# Altium project Power bank.PrjPcb (part 2 of 3)
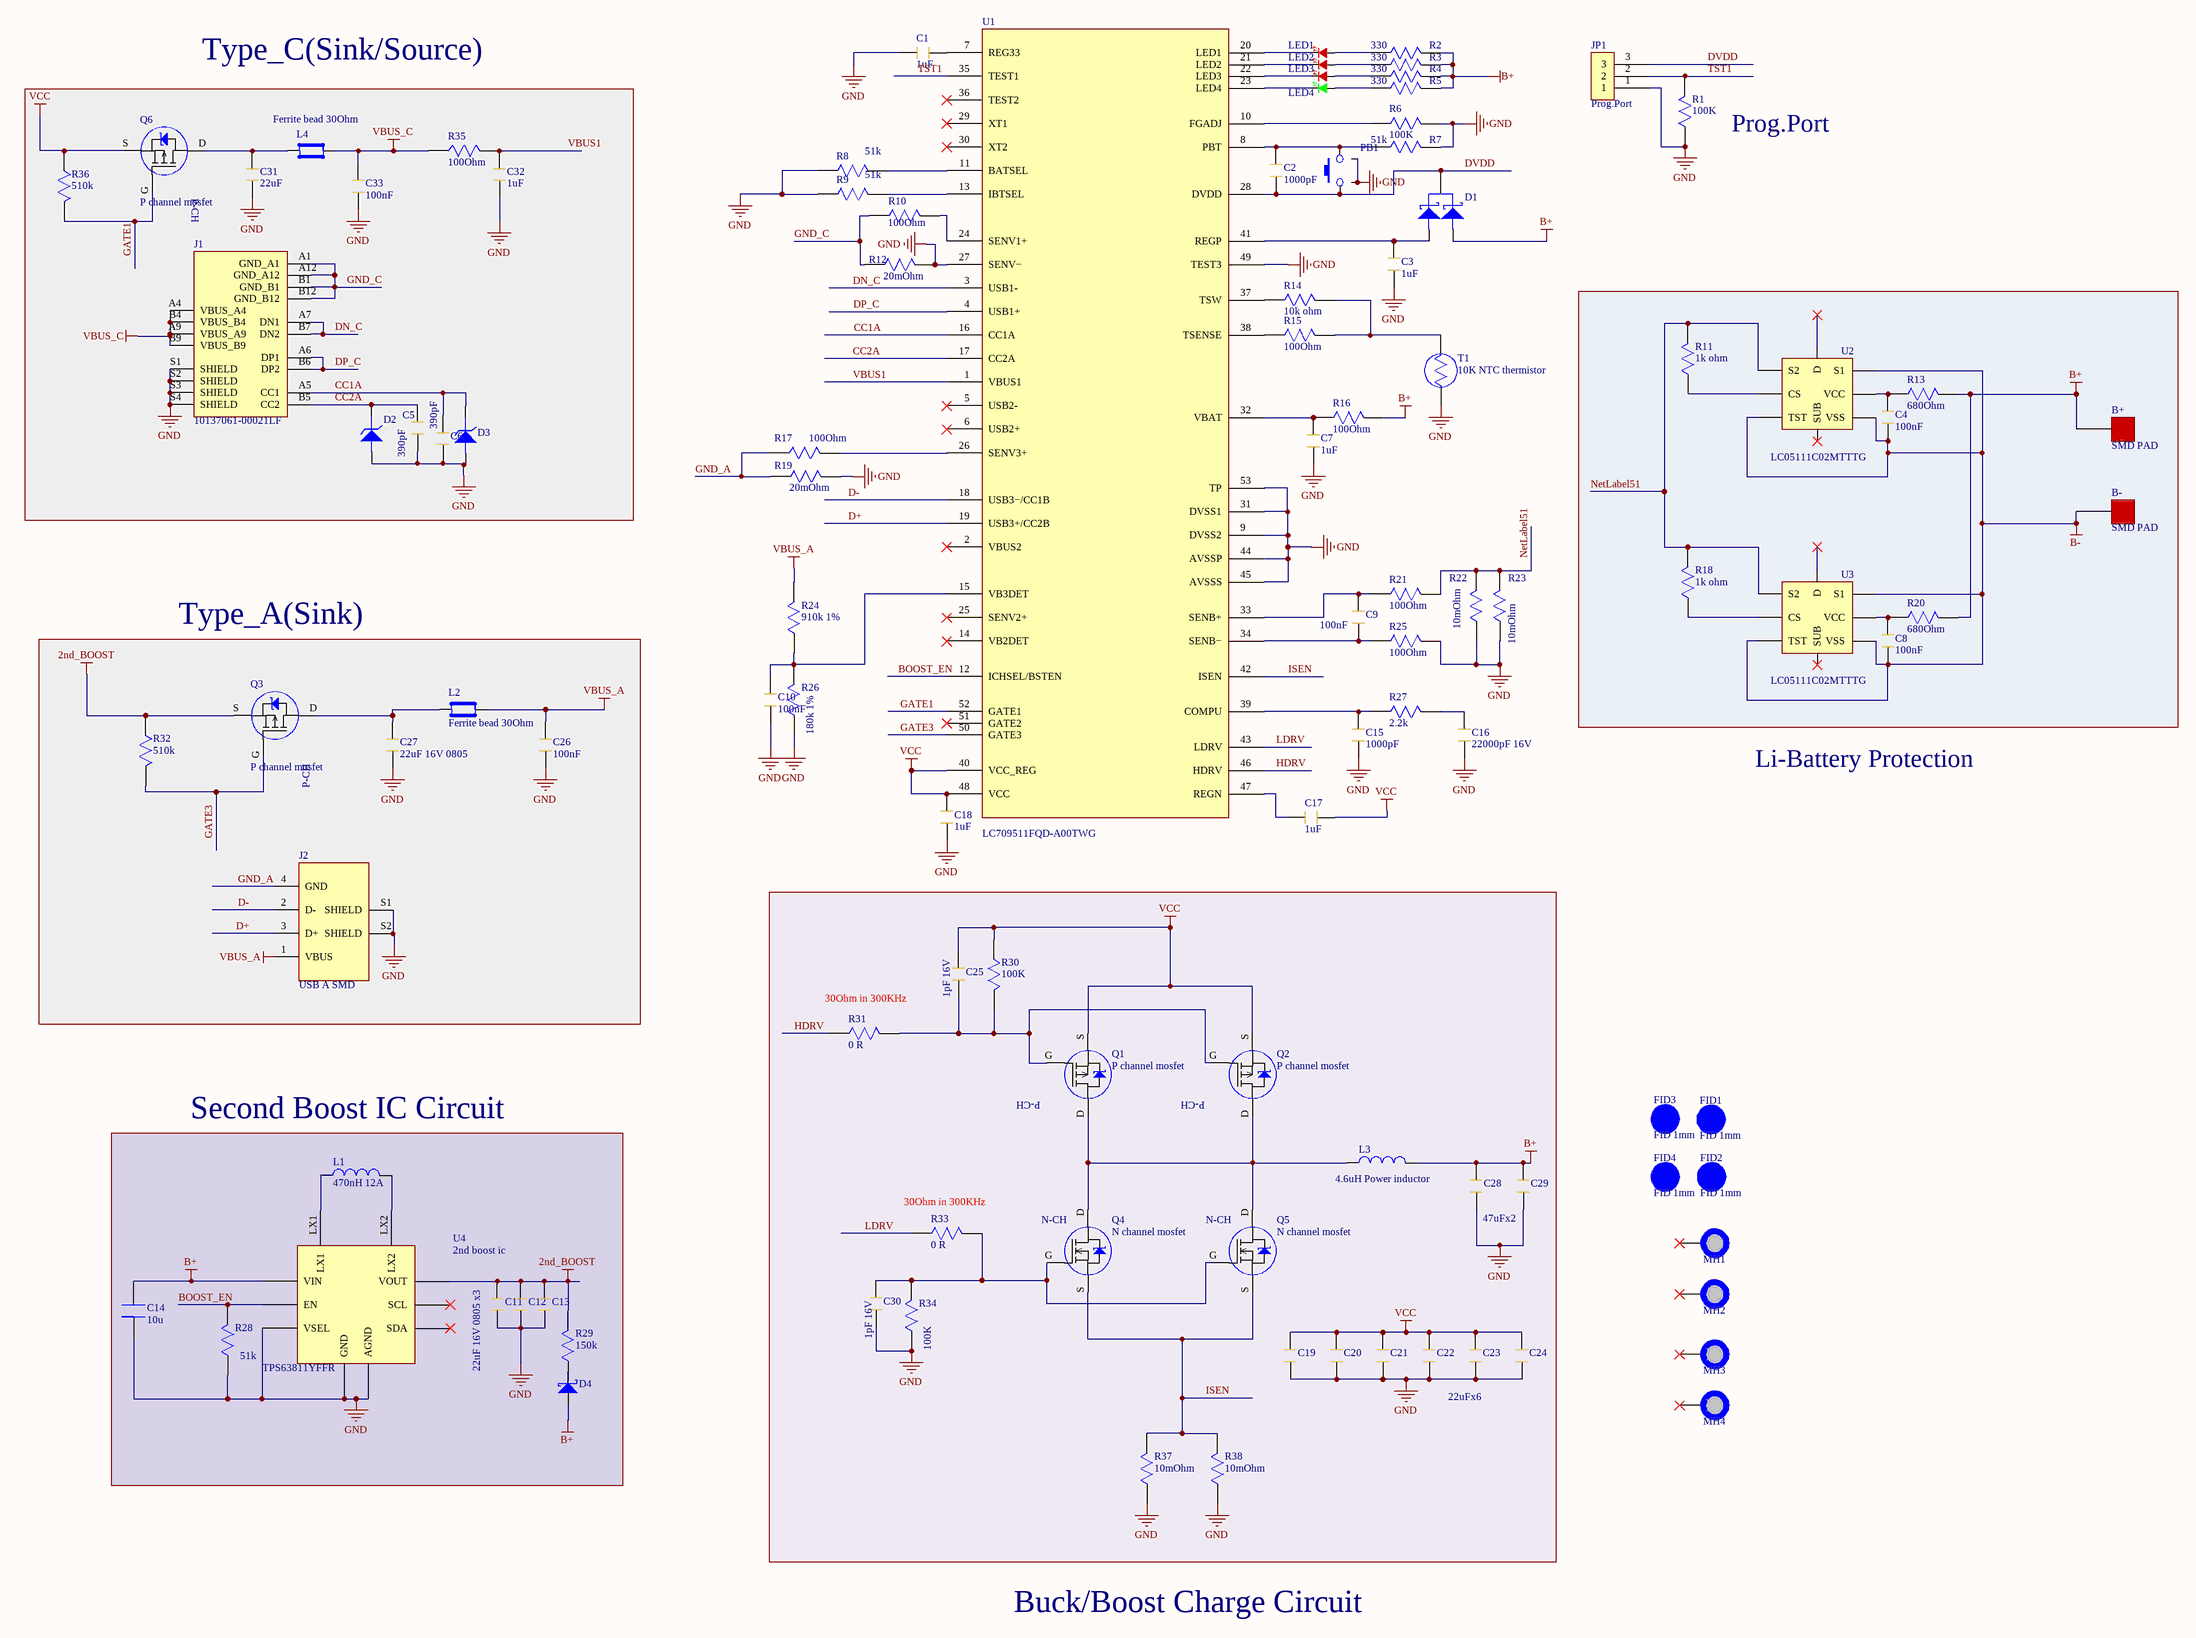
[diagram p1: 4layer schematic.SchDoc]

## Sheet 4layer schematic.SchDoc: Power Bank   by Abdelrahman Ahmed (continued)
### Library data of the parts
C1 C3 C7 C17 C18 C32 = 1uF cap: Cap Ceramic 1uF 16V Y5V -20% to 80% SMD 0603 85C T/R; Manufacturer 1: Yageo; Manufacturer Part Number 1: CC0603ZRY5V7BB105; Dissipation Factor: 12.5%; Supplier 1: Digi-Key; Stock 1: 1011162; Pricing 1: 1=0.10000, 10=0.07600, 50=0.04160, 100=0.03400, 500=0.02426, 1000=0.01906 (USD); RoHS: Yes; Mount: Surface Mount; Case/Package: 0603; Case Code (Metric): 1608; Case Code (Imperial): 0603; Min Operating Temperature: -30°C; Max Operating Temperature: 85°C; Voltage Rating (DC): 16V; Dielectric: Y5V; Termination: SMD/SMT; Composition: Ceramic; Capacitance: 1uF; Tolerance: 80%; Package Quantity: 1; Voltage Rating: 16V; Packaging: Tape and Reel; Length: 1.6mm; Height: 0.8mm; Thickness: 0.035inch; Depth: 0.8mm; Width: 0.031inch; Radiation Hardening: No; REACH SVHC: Unknown; Lead Free: Lead Free; Halogen Free: Halogen Free; ComponentLink1URL: https://datasheet.ciiva.com/26936/getdatasheetpartid-782716-26936063.pdf?src-supplier=Verical; ComponentLink1Description: https://datasheet.ciiva.com/26936/getdatasheetpartid-782716-26936063.pdf?src-supplier=Verical; ComponentLink2URL: https://datasheet.ciiva.com/144/mlccorderingcode-144385.pdf?src-supplier=Digi-Key; ComponentLink2Description: https://datasheet.ciiva.com/144/mlccorderingcode-144385.pdf?src-supplier=Digi-Key; ComponentLink3URL: https://datasheet.ciiva.com/144/mlccorderingcode-144386.pdf?src-supplier=Digi-Key; ComponentLink3Description: https://datasheet.ciiva.com/144/mlccorderingcode-144386.pdf?src-supplier=Digi-Key; ComponentLink4URL: https://datasheet.ciiva.com/144/mlccorderingcode-144387.pdf?src-supplier=Digi-Key; ComponentLink4Description: https://datasheet.ciiva.com/144/mlccorderingcode-144387.pdf?src-supplier=Digi-Key; ComponentLink5URL: https://datasheet.ciiva.com/7978/1132289-7978188.pdf?src-supplier=Element14; ComponentLink5Description: https://datasheet.ciiva.com/7978/1132289-7978188.pdf?src-supplier=Element14; ComponentLink6URL: https://datasheet.ciiva.com/11587/upy-gphc-y5v-6-3v-to-50v-5-11587228.pdf?src-supplier=Avnet; ComponentLink6Description: https://datasheet.ciiva.com/11587/upy-gphc-y5v-6-3v-to-50v-5-11587228.pdf?src-supplier=Avnet; ComponentLink7URL: https://datasheet.ciiva.com/5425/upy-gphc-y5v-6-3v-to-50v-5-5425454.pdf?src-supplier=Mouser; ComponentLink7Description: https://datasheet.ciiva.com/5425/upy-gphc-y5v-6-3v-to-50v-5-5425454.pdf?src-supplier=Mouser; ComponentLink8URL: https://datasheet.ciiva.com/16623/upy-gphc-y5v-6-3v-to-50v-5-16623902.pdf?src-supplier=Avnet+Europe; ComponentLink8Description: https://datasheet.ciiva.com/16623/upy-gphc-y5v-6-3v-to-50v-5-16623902.pdf?src-supplier=Avnet+Europe; Supplier Part Number 1: 311-1372-1-ND
C2 C15 = 1000pF cap: Cap Ceramic 0.001uF 16V X7R 10% Pad SMD 0402 125C T/R; Manufacturer 1: Yageo; Manufacturer Part Number 1: CC0402KRX7R7BB102; Capacitance: 1nF; Supplier 1: Digi-Key; Stock 1: 549923; Pricing 1: 1=0.10000, 10=0.02000, 50=0.01120, 100=0.00910, 500=0.00650, 1000=0.00511, 2500=0.00465, 5000=0.00428 (USD); RoHS: Yes; Mount: Surface Mount; Case/Package: 0402; Case Code (Imperial): 0402; Case Code (Metric): 1005; Min Operating Temperature: -55°C; Max Operating Temperature: 125°C; Packaging: Tape and Reel; Tolerance: 10%; Voltage Rating: 16V; Voltage Rating (DC): 16V; Package Quantity: 1; Dielectric: X7R; Termination: SMD/SMT; Composition: Ceramic; Length: 1mm; Height: 0.5mm; Width: 0.5mm; Thickness: 0.022inch; Depth: 0.5mm; Radiation Hardening: No; REACH SVHC: No SVHC; Lead Free: Lead Free; Halogen Free: Halogen Free; ComponentLink1URL: https://datasheet.ciiva.com/143/mlccorderingcode-143963.pdf?src-supplier=Digi-Key; ComponentLink1Description: https://datasheet.ciiva.com/143/mlccorderingcode-143963.pdf?src-supplier=Digi-Key; ComponentLink2URL: https://datasheet.ciiva.com/26862/getdatasheetpartid-698313-26862635.pdf?src-supplier=Verical; ComponentLink2Description: https://datasheet.ciiva.com/26862/getdatasheetpartid-698313-26862635.pdf?src-supplier=Verical; ComponentLink3URL: https://datasheet.ciiva.com/143/mlccorderingcode-143964.pdf?src-supplier=Digi-Key; ComponentLink3Description: https://datasheet.ciiva.com/143/mlccorderingcode-143964.pdf?src-supplier=Digi-Key; ComponentLink4URL: https://datasheet.ciiva.com/17437/upy-gphc-x7r-6-3v-to-50v-8-17437337.pdf?src-supplier=Avnet+Europe; ComponentLink4Description: https://datasheet.ciiva.com/17437/upy-gphc-x7r-6-3v-to-50v-8-17437337.pdf?src-supplier=Avnet+Europe; ComponentLink5URL: https://datasheet.ciiva.com/143/mlccorderingcode-143962.pdf?src-supplier=Digi-Key; ComponentLink5Description: https://datasheet.ciiva.com/143/mlccorderingcode-143962.pdf?src-supplier=Digi-Key; ComponentLink6URL: https://datasheet.ciiva.com/7978/1489800-7978107.pdf?src-supplier=Element14; ComponentLink6Description: https://datasheet.ciiva.com/7978/1489800-7978107.pdf?src-supplier=Element14; ComponentLink7URL: https://datasheet.ciiva.com/11464/upy-gphc-x7r-6-3v-to-50v-8-11464876.pdf?src-supplier=Avnet; ComponentLink7Description: https://datasheet.ciiva.com/11464/upy-gphc-x7r-6-3v-to-50v-8-11464876.pdf?src-supplier=Avnet; Supplier Part Number 1: 311-1352-6-ND
C4 C8-C10 = 0.1uF cap: Cap Ceramic 0.1uF 16V X7R 10% SMD 0402 125C Paper T/R; Manufacturer 1: Yageo; Manufacturer Part Number 1: CC0402KPX7R7BB104; Supplier 1: Digi-Key; Stock 1: 61577; Pricing 1: 1=0.10000, 10=0.03200, 50=0.01760, 100=0.01430, 500=0.01024, 1000=0.00805, 2500=0.00732, 5000=0.00673 (USD); RoHS: Yes; Mount: Surface Mount; Case/Package: 0402; Weight: 2.3E-05oz; Case Code (Imperial): 0402; Case Code (Metric): 1005; Min Operating Temperature: -55°C; Max Operating Temperature: 125°C; Tolerance: 10%; Packaging: Tape and Reel; Capacitance: 100nF; Voltage Rating (DC): 16V; Dielectric: X7R; Termination: SMD/SMT; Composition: Ceramic; Voltage Rating: 16V; Length: 0.039inch; Width: 0.02inch; Thickness: 0.022inch; Depth: 0.5mm; Lead Free: Lead Free; Halogen Free: Halogen Free; ComponentLink1URL: https://datasheet.ciiva.com/13207/upy-gphc-x7r-6-3v-to-50v-8-12304-13207933.pdf?src-supplier=Mouser; ComponentLink1Description: https://datasheet.ciiva.com/13207/upy-gphc-x7r-6-3v-to-50v-8-12304-13207933.pdf?src-supplier=Mouser; Supplier Part Number 1: 311-3559-1-ND
C5 C6 = 390pF smd cap: Cap Ceramic 390pF 16V X7R 10% SMD 0201 125C Paper T/R; Manufacturer 1: Kyocera AVX; Manufacturer Part Number 1: 0201YC391KAT2A; Supplier 1: Digi-Key; Stock 1: 15630; Pricing 1: 1=0.39000, 10=0.27200, 50=0.19060, 100=0.16340, 500=0.12252, 1000=0.10346, 2500=0.09801, 5000=0.09257 (USD); RoHS: Yes; Mount: Surface Mount; Case/Package: 0201; Number of Pins: 2; Case Code (Imperial): 0201; Case Code (Metric): 0603; Min Operating Temperature: -55°C; Max Operating Temperature: 125°C; Capacitance: 390pF; Tolerance: 10%; Voltage Rating: 16V; Package Quantity: 1; Voltage Rating (DC): 16V; Packaging: Tape and Reel; Dielectric: X7R; Termination: SMD/SMT; Length: 0.6mm; Width: 0.3mm; Thickness: 0.013inch; Depth: 0.3mm; Radiation Hardening: No; REACH SVHC: Unknown; Lead Free: Lead Free; ComponentLink1URL: https://datasheet.ciiva.com/152/cx7r-152454.pdf?src-supplier=Digi-Key; ComponentLink1Description: https://datasheet.ciiva.com/152/cx7r-152454.pdf?src-supplier=Digi-Key; ComponentLink2URL: https://datasheet.ciiva.com/152/cx7r-152455.pdf?src-supplier=Digi-Key; ComponentLink2Description: https://datasheet.ciiva.com/152/cx7r-152455.pdf?src-supplier=Digi-Key; ComponentLink3URL: https://datasheet.ciiva.com/152/cx7r-152456.pdf?src-supplier=Digi-Key; ComponentLink3Description: https://datasheet.ciiva.com/152/cx7r-152456.pdf?src-supplier=Digi-Key; Supplier Part Number 1: 478-1034-1-ND
C11-C13 C19-C24 C27 C31 = GRM21BR61C226ME44L: Cap Ceramic 22uF 16V X5R 20% Pad SMD 0805 85C T/R
C14 = C2012X5R1C106M125AC: CAP CER 10UF 16V X5R 0805; Manufacturer 1: TDK; Dielectric Material: Ceramic; Tolerance: 20%; Supplier 1: Farnell; Manufacturer Part Number 1: C2012X5R1C106M125AC; Stock 1: 0; Pricing 1: 5=0.27200, 50=0.09480, 250=0.08030, 500=0.07090, 1000=0.06220, 2000=0.04880, 10000=0.04830, 20000=0.04180 (GBP); RoHS: Yes; Mount: Surface Mount; Case/Package: 0805; Number of Pins: 2; Weight: 0.000194oz; Case Code (Metric): 2012; Case Code (Imperial): 0805; Min Operating Temperature: -55°C; Max Operating Temperature: 85°C; Capacitance: 10uF; Voltage Rating: 16V; Packaging: Tape and Reel; Voltage Rating (DC): 16V; Dielectric: X5R; Termination: SMD/SMT; Package Quantity: 1; Composition: Ceramic; Length: 2mm; Height: 1.25mm; Width: 0.049inch; Depth: 1.25mm; Thickness: 0.057inch; REACH SVHC: No SVHC; Lead Free: Lead Free; ComponentLink1URL: https://datasheet.ciiva.com/6289/tdkmlcccaprange-6289238.pdf?src-supplier=Digi-Key; ComponentLink1Description: https://datasheet.ciiva.com/6289/tdkmlcccaprange-6289238.pdf?src-supplier=Digi-Key; ComponentLink2URL: https://datasheet.ciiva.com/22725/1913358-22725558.pdf?src-supplier=Element14; ComponentLink2Description: https://datasheet.ciiva.com/22725/1913358-22725558.pdf?src-supplier=Element14; ComponentLink3URL: https://datasheet.ciiva.com/6252/tdkmlcccaprange-6252105.pdf?src-supplier=Digi-Key; ComponentLink3Description: https://datasheet.ciiva.com/6252/tdkmlcccaprange-6252105.pdf?src-supplier=Digi-Key; ComponentLink4URL: https://datasheet.ciiva.com/6252/tdkmlcccaprange-6252108.pdf?src-supplier=Digi-Key; ComponentLink4Description: https://datasheet.ciiva.com/6252/tdkmlcccaprange-6252108.pdf?src-supplier=Digi-Key; ComponentLink5URL: https://datasheet.ciiva.com/23803/1796654-23803022.pdf?src-supplier=Newark; ComponentLink5Description: https://datasheet.ciiva.com/23803/1796654-23803022.pdf?src-supplier=Newark; Supplier Part Number 1: 2525134
C16 = 22000pF cap: YAGEO - CC0402KRX7R7BB223 - SMD Multilayer Ceramic Capacitor, 22000 pF, 16 V, 0402 [1005 Metric], ± 10%, X7R, CC Series; Capacitance: 22nF; Insulation Resistance: 10GR; Dissipation Factor: 3.5%; Supplier 1: Digi-Key; Manufacturer 1: Yageo; Manufacturer Part Number 1: CC0402KRX7R7BB223; Stock 1: 283527; Pricing 1: 1=0.10000, 10=0.03000, 50=0.01620, 100=0.01320, 500=0.00940, 1000=0.00738, 2500=0.00671, 5000=0.00617 (USD); RoHS: Yes; Mount: Surface Mount; Case/Package: 0402; Number of Pins: 2; Case Code (Imperial): 0402; Case Code (Metric): 1005; Dielectric Material: Ceramic; Min Operating Temperature: -55°C; Max Operating Temperature: 125°C; Tolerance: 10%; Voltage Rating: 16V; Package Quantity: 1; Voltage Rating (DC): 16V; Packaging: Tape and Reel; Dielectric: X7R; Termination: SMD/SMT; Composition: Ceramic; Length: 1mm; Height: 0.5mm; Width: 0.5mm; Thickness: 0.022inch; Depth: 0.5mm; Radiation Hardening: No; REACH SVHC: No SVHC; Lead Free: Lead Free; Halogen Free: Halogen Free; ComponentLink1URL: https://datasheet.ciiva.com/144/mlccorderingcode-144037.pdf?src-supplier=Digi-Key; ComponentLink1Description: https://datasheet.ciiva.com/144/mlccorderingcode-144037.pdf?src-supplier=Digi-Key; ComponentLink2URL: https://datasheet.ciiva.com/8033/1489800-8033669.pdf?src-supplier=Element14; ComponentLink2Description: https://datasheet.ciiva.com/8033/1489800-8033669.pdf?src-supplier=Element14; ComponentLink3URL: https://datasheet.ciiva.com/15189/getdatasheetpartid-321421-15189125.pdf?src-supplier=Verical; ComponentLink3Description: https://datasheet.ciiva.com/15189/getdatasheetpartid-321421-15189125.pdf?src-supplier=Verical; ComponentLink4URL: https://datasheet.ciiva.com/144/mlccorderingcode-144038.pdf?src-supplier=Digi-Key; ComponentLink4Description: https://datasheet.ciiva.com/144/mlccorderingcode-144038.pdf?src-supplier=Digi-Key; ComponentLink5URL: https://datasheet.ciiva.com/28450/1489800-28450342.pdf?src-supplier=Element14; ComponentLink5Description: https://datasheet.ciiva.com/28450/1489800-28450342.pdf?src-supplier=Element14; ComponentLink6URL: https://datasheet.ciiva.com/144/mlccorderingcode-144039.pdf?src-supplier=Digi-Key; ComponentLink6Description: https://datasheet.ciiva.com/144/mlccorderingcode-144039.pdf?src-supplier=Digi-Key; ComponentLink7URL: https://datasheet.ciiva.com/8033/1489800-8033671.pdf?src-supplier=Element14; ComponentLink7Description: https://datasheet.ciiva.com/8033/1489800-8033671.pdf?src-supplier=Element14; Supplier Part Number 1: 311-1378-1-ND
C25 C30 = 1pF 16V cap: WURTH ELEKTRONIK - 885012005019 - CAP, 1PF, 16V, C0G/NP0, 0402; Manufacturer 1: Wurth Electronics; Supplier 1: Digi-Key; Manufacturer Part Number 1: 885012005019; Stock 1: 8704; Pricing 1: 1=0.10000, 10=0.01700, 100=0.01570, 500=0.01386 (USD); RoHS: Yes; Mount: Surface Mount; Case/Package: 0402; Case Code (Metric): 1005; Case Code (Imperial): 0402; Min Operating Temperature: -55°C; Max Operating Temperature: 125°C; Packaging: Tape and Reel; Capacitance: 1pF; Voltage Rating: 16V; Length: 0.039inch; Width: 0.02inch; Thickness: 0.022inch; ComponentLink1URL: http://www.farnell.com/datasheets/2546550.pdf?src-supplier=Farnell; ComponentLink1Description: http://www.farnell.com/datasheets/2546550.pdf?src-supplier=Farnell; ComponentLink2URL: https://katalog.we-online.de/pbs/datasheet/885012005019.pdf?src-supplier=Digi-Key; ComponentLink2Description: https://katalog.we-online.de/pbs/datasheet/885012005019.pdf?src-supplier=Digi-Key; ComponentLink3URL: http://katalog.we-online.de/pbs/datasheet/885012005019.pdf?src-supplier=Digi-Key; ComponentLink3Description: http://katalog.we-online.de/pbs/datasheet/885012005019.pdf?src-supplier=Digi-Key; Supplier Part Number 1: 732-7435-1-ND
C26 C33 = C2012X7R1H104K085AA: CAP CER 0.1UF 50V X7R 0805; Manufacturer 1: TDK; Dielectric Material: Ceramic; Tolerance: 10%; Supplier 1: Digi-Key; Manufacturer Part Number 1: C2012X7R1H104K085AA; Stock 1: 38824; Pricing 1: 1=0.17000, 10=0.11900, 100=0.05610, 500=0.03936, 1000=0.03258 (USD); RoHS: Yes; Mount: Surface Mount; Case/Package: 0805; Number of Pins: 2; Weight: 0.000194oz; Case Code (Metric): 2012; Case Code (Imperial): 0805; Min Operating Temperature: -55°C; Max Operating Temperature: 125°C; Capacitance: 100nF; Dielectric: X7R; Voltage Rating: 50V; Packaging: Tape and Reel; Voltage Rating (DC): 50V; Termination: SMD/SMT; Package Quantity: 1; Composition: Ceramic; Voltage: 50V; Length: 2mm; Height: 0.85mm; Depth: 1.25mm; Width: 0.049inch; Thickness: 0.037inch; Radiation Hardening: No; REACH SVHC: No SVHC; Lead Free: Lead Free; ComponentLink1URL: https://datasheet.ciiva.com/11788/0900766b80c1bb00-11788128.pdf?src-supplier=RSComponents; ComponentLink1Description: https://datasheet.ciiva.com/11788/0900766b80c1bb00-11788128.pdf?src-supplier=RSComponents; ComponentLink2URL: https://datasheet.ciiva.com/6250/tdkmlcccaprange-6250821.pdf?src-supplier=Digi-Key; ComponentLink2Description: https://datasheet.ciiva.com/6250/tdkmlcccaprange-6250821.pdf?src-supplier=Digi-Key; ComponentLink3URL: https://datasheet.ciiva.com/24191/e412-c-24191447.pdf?src-supplier=Future+Electronics; ComponentLink3Description: https://datasheet.ciiva.com/24191/e412-c-24191447.pdf?src-supplier=Future+Electronics; ComponentLink4URL: https://datasheet.ciiva.com/6250/tdkmlcccaprange-6250824.pdf?src-supplier=Digi-Key; ComponentLink4Description: https://datasheet.ciiva.com/6250/tdkmlcccaprange-6250824.pdf?src-supplier=Digi-Key; ComponentLink5URL: https://datasheet.ciiva.com/23803/1796654-23803035.pdf?src-supplier=Newark; ComponentLink5Description: https://datasheet.ciiva.com/23803/1796654-23803035.pdf?src-supplier=Newark; ComponentLink6URL: https://datasheet.ciiva.com/28602/1571323-28602204.pdf?src-supplier=Element14; ComponentLink6Description: https://datasheet.ciiva.com/28602/1571323-28602204.pdf?src-supplier=Element14; Supplier Part Number 1: 445-7534-1-ND
C28 C29 = 47uF cap: KEMET - C1210C476M4PACTU. - CAPACITOR CERAMIC 47UF, 16V, X5R, 1210; Tolerance: 20%; Dissipation Factor: 10%; Supplier 1: Digi-Key; Manufacturer 1: KEMET; Manufacturer Part Number 1: C1210C476M4PACTU; Stock 1: 225249; Pricing 1: 1=1.16000, 10=0.88500, 50=0.73500, 100=0.63300, 500=0.49006 (USD); RoHS: Yes; Mount: Surface Mount,PCB; Case/Package: 1210; Number of Pins: 2; Case Code (Metric): 3225; Case Code (Imperial): 1210; Contact Plating: Tin,Matte; Dielectric Material: Ceramic; Min Operating Temperature: -55°C; Max Operating Temperature: 85°C; Package Quantity: 1; Capacitance: 47uF; Voltage Rating: 16V; Packaging: Tape and Reel; Voltage Rating (DC): 16V; Dielectric: X5R; Termination: SMD/SMT; Voltage: 16V; Length: 3.2mm; Height: 2.5mm; Width: 0.098inch; Thickness: 0.11inch; Depth: 2.5mm; Radiation Hardening: No; REACH SVHC: No SVHC; Lead Free: Lead Free; ComponentLink1URL: https://datasheet.ciiva.com/22705/652158-22705488.pdf?src-supplier=Element14; ComponentLink1Description: https://datasheet.ciiva.com/22705/652158-22705488.pdf?src-supplier=Element14; ComponentLink2URL: https://datasheet.ciiva.com/28608/1918694-28608774.pdf?src-supplier=Element14; ComponentLink2Description: https://datasheet.ciiva.com/28608/1918694-28608774.pdf?src-supplier=Element14; Supplier Part Number 1: 399-5514-1-ND
D1 = 3pins schottkey common cathode: Diode Schottky 30V 0.2A 3-Pin SOT-23 T/R; Manufacturer 1: ON Semiconductor; Manufacturer Part Number 1: SBAT54CLT1G; Forward Current: 200mA; Max Power Dissipation: 225mW; Recovery Time: 5ns; Max Reverse Leakage Current: 2uA; Peak Non-Repetitive Surge Current: 600mA; Supplier 1: Digi-Key; Stock 1: 24603; Pricing 1: 1=0.36000, 10=0.29600, 25=0.24760, 100=0.12100, 500=0.10092, 1000=0.07013 (USD); RoHS: Yes; Case/Package: SOT-23-3; Number of Pins: 3; Min Operating Temperature: -55°C; Max Operating Temperature: 125°C; Package Quantity: 3000; Element Configuration: Common Cathode; Packaging: Tape and Reel; Max Repetitive Reverse Voltage (Vrrm): 30V; Max Reverse Voltage (DC): 30V; Average Rectified Current: 200mA; Reverse Recovery Time: 5ns; Max Forward Surge Current (Ifsm): 600mA; Radiation Hardening: No; Lead Free: Lead Free; Halogen Free: Halogen Free; ComponentLink1URL: https://datasheet.ciiva.com/908/bat54clt1-d-908339.pdf?src-supplier=Digi-Key; ComponentLink1Description: https://datasheet.ciiva.com/908/bat54clt1-d-908339.pdf?src-supplier=Digi-Key; ComponentLink2URL: https://datasheet.ciiva.com/8292/bat54clt1-d-8292853.pdf?src-supplier=Avnet; ComponentLink2Description: https://datasheet.ciiva.com/8292/bat54clt1-d-8292853.pdf?src-supplier=Avnet; Supplier Part Number 1: SBAT54CLT1GOSCT-ND
D2 D3 = MM5Z5V1T1G: ON SEMICONDUCTOR - MM5Z5V1T1G - Zener Single Diode, General Purpose, 5.1 V, 500 mW, SOD-523, 2, 150 C RoHS Compliant: Yes; Material: Plastic; Max Power Dissipation: 200mW; Tolerance: 6%; Forward Voltage: 900mV; Impedance: 60R; Max Reverse Leakage Current: 2uA; Test Current: 5mA; Power Rating: 100mW; Supplier 1: Digi-Key; Manufacturer 1: ON Semiconductor; Manufacturer Part Number 1: MM5Z5V1T1G; Stock 1: 14960; Pricing 1: 1=0.21000, 10=0.14400, 100=0.07680, 500=0.04400, 1000=0.03680 (USD); RoHS: Yes; Case/Package: SOD-523-2; Number of Pins: 2; Min Operating Temperature: -65°C; Max Operating Temperature: 150°C; Packaging: Tape and Reel; Package Quantity: 3000; Zener Voltage: 5.1V; Power Dissipation: 200mW; Working Voltage: 5.1V; Peak Reverse Current: 2uA; Element Configuration: Single; Voltage Rating (DC): 5.1V; Voltage Tolerance: 6%; Zener Current: 10mA; Length: 1.3mm; Height: 0.7mm; Width: 0.9mm; Radiation Hardening: No; Lead Free: Lead Free; REACH SVHC: No SVHC; ComponentLink1URL: https://datasheet.ciiva.com/15142/getdatasheetpartid-53273-15142116.pdf?src-supplier=Verical; ComponentLink1Description: https://datasheet.ciiva.com/15142/getdatasheetpartid-53273-15142116.pdf?src-supplier=Verical; ComponentLink2URL: https://datasheet.ciiva.com/30478/0900766b81276ad7-30478633.pdf?src-supplier=RSComponents; ComponentLink2Description: https://datasheet.ciiva.com/30478/0900766b81276ad7-30478633.pdf?src-supplier=RSComponents; ComponentLink3URL: https://datasheet.ciiva.com/900/mm5z2v4t1-d-900082.pdf?src-supplier=Digi-Key; ComponentLink3Description: https://datasheet.ciiva.com/900/mm5z2v4t1-d-900082.pdf?src-supplier=Digi-Key; ComponentLink4URL: https://datasheet.ciiva.com/900/mm5z2v4t1-d-900083.pdf?src-supplier=Digi-Key; ComponentLink4Description: https://datasheet.ciiva.com/900/mm5z2v4t1-d-900083.pdf?src-supplier=Digi-Key; ComponentLink5URL: https://datasheet.ciiva.com/900/mm5z2v4t1-d-900084.pdf?src-supplier=Digi-Key; ComponentLink5Description: https://datasheet.ciiva.com/900/mm5z2v4t1-d-900084.pdf?src-supplier=Digi-Key; ComponentLink6URL: https://datasheet.ciiva.com/8347/mm5z2v4t1-d-8347925.pdf?src-supplier=Avnet; ComponentLink6Description: https://datasheet.ciiva.com/8347/mm5z2v4t1-d-8347925.pdf?src-supplier=Avnet; ComponentLink7URL: https://datasheet.ciiva.com/8347/mm5z2v4t1-d-8347930.pdf?src-supplier=Avnet; ComponentLink7Description: https://datasheet.ciiva.com/8347/mm5z2v4t1-d-8347930.pdf?src-supplier=Avnet; ComponentLink8URL: https://datasheet.ciiva.com/26092/mm5z2v4t1-d-26092203.pdf?src-supplier=Avnet+Europe; ComponentLink8Description: https://datasheet.ciiva.com/26092/mm5z2v4t1-d-26092203.pdf?src-supplier=Avnet+Europe; Supplier Part Number 1: MM5Z5V1T1GOSCT-ND
D4 = BAT54HT1G: DIODE SCHOTTKY 30V 200MA SOD323; Manufacturer 1: ON Semiconductor / Fairchild; Forward Voltage: 800mV; Recovery Time: 5ns; Peak Non-Repetitive Surge Current: 600mA; Element Configuration: Single; Peak Reverse Current: 2uA; Power Dissipation: 200mW; Polarity: Standard; Capacitance: 10pF; Max Power Dissipation: 225mW; Supplier 1: Digi-Key; Manufacturer Part Number 1: BAT54HT1G; Stock 1: 736672; Pricing 1: 1=0.20000, 10=0.18700, 100=0.10160, 500=0.06252, 1000=0.04263 (USD); RoHS: Yes; Mount: Surface Mount; Number of Pins: 2; Contact Plating: Tin,Matte; Min Operating Temperature: -55°C; Max Operating Temperature: 150°C; Packaging: Tape and Reel; Package Quantity: 3000; Forward Current: 200mA; Average Rectified Current: 200mA; Reverse Recovery Time: 5ns; Max Repetitive Reverse Voltage (Vrrm): 30V; Max Forward Surge Current (Ifsm): 600mA; Max Reverse Voltage (DC): 30V; Max Surge Current: 600mA; Voltage Rating (DC): 30V; Current Rating: 200mA; Output Current: 200mA; Reverse Voltage: 30V; Max Reverse Leakage Current: 2uA; Length: 1.8mm; Height: 1mm; Width: 1.35mm; Radiation Hardening: No; Lead Free: Lead Free; REACH SVHC: No SVHC; ComponentLink1URL: https://datasheet.ciiva.com/4714/bat54ht1-d-72881-4714706.pdf?src-supplier=Mouser; ComponentLink1Description: https://datasheet.ciiva.com/4714/bat54ht1-d-72881-4714706.pdf?src-supplier=Mouser; ComponentLink2URL: https://datasheet.ciiva.com/30479/0900766b811a63a9-30479442.pdf?src-supplier=RSComponents; ComponentLink2Description: https://datasheet.ciiva.com/30479/0900766b811a63a9-30479442.pdf?src-supplier=RSComponents; ComponentLink3URL: https://datasheet.ciiva.com/34301/806549-34301562.pdf?src-supplier=Jameco; ComponentLink3Description: https://datasheet.ciiva.com/34301/806549-34301562.pdf?src-supplier=Jameco; ComponentLink4URL: https://datasheet.ciiva.com/1240/1747983-1240762.pdf?src-supplier=Newark; ComponentLink4Description: https://datasheet.ciiva.com/1240/1747983-1240762.pdf?src-supplier=Newark; ComponentLink5URL: https://datasheet.ciiva.com/4452/bat54ht1g-104602-4452889.pdf?src-supplier=Mouser; ComponentLink5Description: https://datasheet.ciiva.com/4452/bat54ht1g-104602-4452889.pdf?src-supplier=Mouser; ComponentLink6URL: https://datasheet.ciiva.com/910/bat54ht1g-910497.pdf?src-supplier=Digi-Key; ComponentLink6Description: https://datasheet.ciiva.com/910/bat54ht1g-910497.pdf?src-supplier=Digi-Key; ComponentLink7URL: https://datasheet.ciiva.com/1180/bat54ht1-d-1180252.pdf?src-supplier=Element14; ComponentLink7Description: https://datasheet.ciiva.com/1180/bat54ht1-d-1180252.pdf?src-supplier=Element14; ComponentLink8URL: https://datasheet.ciiva.com/1180/bat54ht1-d-1180251.pdf?src-supplier=Element14; ComponentLink8Description: https://datasheet.ciiva.com/1180/bat54ht1-d-1180251.pdf?src-supplier=Element14; ComponentLink9URL: https://datasheet.ciiva.com/46429/1727620-46429206.pdf?src-supplier=Element14; ComponentLink9Description: https://datasheet.ciiva.com/46429/1727620-46429206.pdf?src-supplier=Element14; ComponentLink10URL: https://datasheet.ciiva.com/8294/bat54ht1-d-8294645.pdf?src-supplier=Avnet; ComponentLink10Description: https://datasheet.ciiva.com/8294/bat54ht1-d-8294645.pdf?src-supplier=Avnet; ComponentLink11URL: https://datasheet.ciiva.com/915/bat54ht1-d-915445.pdf?src-supplier=Digi-Key; ComponentLink11Description: https://datasheet.ciiva.com/915/bat54ht1-d-915445.pdf?src-supplier=Digi-Key; ComponentLink12URL: https://datasheet.ciiva.com/915/bat54ht1-d-915444.pdf?src-supplier=Digi-Key; ComponentLink12Description: https://datasheet.ciiva.com/915/bat54ht1-d-915444.pdf?src-supplier=Digi-Key; ComponentLink13URL: https://datasheet.ciiva.com/915/bat54ht1-d-915443.pdf?src-supplier=Digi-Key; ComponentLink13Description: https://datasheet.ciiva.com/915/bat54ht1-d-915443.pdf?src-supplier=Digi-Key; ComponentLink14URL: https://datasheet.ciiva.com/910/bat54ht1g-910499.pdf?src-supplier=Digi-Key; ComponentLink14Description: https://datasheet.ciiva.com/910/bat54ht1g-910499.pdf?src-supplier=Digi-Key; ComponentLink15URL: https://datasheet.ciiva.com/910/bat54ht1g-910498.pdf?src-supplier=Digi-Key; ComponentLink15Description: https://datasheet.ciiva.com/910/bat54ht1g-910498.pdf?src-supplier=Digi-Key; ComponentLink16URL: https://datasheet.ciiva.com/8303/bat54ht1g-8303645.pdf?src-supplier=Avnet; ComponentLink16Description: https://datasheet.ciiva.com/8303/bat54ht1g-8303645.pdf?src-supplier=Avnet; ComponentLink17URL: https://datasheet.ciiva.com/17020/bat54ht1g-17020445.pdf?src-supplier=Future+Electronics; ComponentLink17Description: https://datasheet.ciiva.com/17020/bat54ht1g-17020445.pdf?src-supplier=Future+Electronics; ComponentLink18URL: https://datasheet.ciiva.com/48686/001262925-da-01-en-diode-schottky-30v-bat54ht1g-sod-323-fsc-48686266.pdf?src-supplier=Conrad; ComponentLink18Description: https://datasheet.ciiva.com/48686/001262925-da-01-en-diode-schottky-30v-bat54ht1g-sod-323-fsc-48686266.pdf?src-supplier=Conrad; Supplier Part Number 1: BAT54HT1GOSCT-ND; Supplier 2: Digi-Key; Manufacturer 2: ON Semiconductor; Manufacturer Part Number 2: SBAT54CLT1G; Stock 2: 24603; Pricing 2: 1=0.36000, 10=0.29600, 25=0.24760, 100=0.12100, 500=0.10092, 1000=0.07013 (USD); Case/Package: SOT-23-3; Halogen Free: Halogen Free; ComponentLink19URL: https://datasheet.ciiva.com/908/bat54clt1-d-908339.pdf?src-supplier=Digi-Key; ComponentLink19Description: https://datasheet.ciiva.com/908/bat54clt1-d-908339.pdf?src-supplier=Digi-Key; ComponentLink20URL: https://datasheet.ciiva.com/8292/bat54clt1-d-8292853.pdf?src-supplier=Avnet; ComponentLink20Description: https://datasheet.ciiva.com/8292/bat54clt1-d-8292853.pdf?src-supplier=Avnet; Supplier Part Number 2: SBAT54CLT1GOSCT-ND
J1 = 10137061-00021LF: Conn USB 3.1 Type C RCP 24 POS 0.5mm Solder RA SMF 24 Terminal 1 Port T/R
J2 = USB A SMD: Socket, angled USB 3.0 A   9 P, 692122030100, Würth Elektronik; Manufacturer 1: Wurth Electronics; Gender: Receptacle; Voltage Rating: 30V; USB Standard: USB 3.0; Current Rating: 1.8A; Connector Type: USB,Receptacle,Socket; Number of Contacts: 9; Number of Ports: 1; Insulation Resistance: 100MR; Supplier 1: Digi-Key; Manufacturer Part Number 1: 692122030100; Stock 1: 2724; Pricing 1: 1=3.17000, 10=2.79600, 50=2.63400, 100=2.36500 (USD); RoHS: Yes; Mount: Surface Mount,Horizontal,Through Hole; Color: Blue; Contact Plating: Gold; Contact Material: Bronze,Copper Alloy; Min Operating Temperature: -20°C; Max Operating Temperature: 85°C; Package Quantity: 1; Packaging: Tape and Reel; Voltage Rating (AC): 30V; Termination: SMD/SMT; Orientation: Right Angle; Features: Shielded; Length: 15.1mm; Width: 16.66mm; REACH SVHC: Unknown; Lead Free: Lead Free; Flammability Rating: UL94 V-0; ComponentLink1URL: https://datasheet.ciiva.com/851/692122030100-851250.pdf?src-supplier=Digi-Key; ComponentLink1Description: https://datasheet.ciiva.com/851/692122030100-851250.pdf?src-supplier=Digi-Key; ComponentLink2URL: https://datasheet.ciiva.com/1099/1699423-1099081.pdf?src-supplier=Element14; ComponentLink2Description: https://datasheet.ciiva.com/1099/1699423-1099081.pdf?src-supplier=Element14; ComponentLink3URL: https://datasheet.ciiva.com/11731/0900766b81023ac1-11731277.pdf?src-supplier=RSComponents; ComponentLink3Description: https://datasheet.ciiva.com/11731/0900766b81023ac1-11731277.pdf?src-supplier=RSComponents; ComponentLink4URL: https://datasheet.ciiva.com/6743/1020404-6743662.pdf?src-supplier=Newark; ComponentLink4Description: https://datasheet.ciiva.com/6743/1020404-6743662.pdf?src-supplier=Newark; ComponentLink5URL: https://datasheet.ciiva.com/851/692122030100-851251.pdf?src-supplier=Digi-Key; ComponentLink5Description: https://datasheet.ciiva.com/851/692122030100-851251.pdf?src-supplier=Digi-Key; ComponentLink6URL: https://datasheet.ciiva.com/851/692122030100-851252.pdf?src-supplier=Digi-Key; ComponentLink6Description: https://datasheet.ciiva.com/851/692122030100-851252.pdf?src-supplier=Digi-Key; Supplier Part Number 1: 732-3150-1-ND
JP1 = 68000-103HLF: CONN HEADER VERT 3POS 2.54MM; Manufacturer 1: Amphenol FCI; Number of Contacts: 3; Current Rating: 3A; Voltage Rating: 1.5kV; Insulation Resistance: 5GR; Gender: Male; Connector Type: Male Pin; Contact Post Length: 2.41mm; Supplier 1: Digi-Key; Manufacturer Part Number 1: 68000-103HLF; Stock 1: 32442; Pricing 1: 1=0.29000, 10=0.27900, 100=0.19500, 500=0.16716, 1000=0.13930, 5000=0.11940, 10000=0.11144 (USD); RoHS: Yes; Mount: Through Hole; Contact Plating: Gold,GXT; Contact Material: Bronze; Color: Black; Housing Color: Black; Housing Material: Thermoplastic; Min Operating Temperature: -65°C; Max Operating Temperature: 125°C; Number of Rows: 1; Termination: Solder; Contact Gender: Male; Package Quantity: 100; Packaging: Bulk; Number of Positions: 3; Max Voltage Rating (AC): 1.5kV; Orientation: Straight; Length: 7.62mm; Pitch: 2.54mm; Contact Mating Length: 0.23inch; Depth: 2.41mm; Radiation Hardening: No; REACH SVHC: No SVHC; Flammability Rating: UL94 V-0; ComponentLink1URL: https://datasheet.ciiva.com/5157/68000-274283-5157301.pdf?src-supplier=Mouser; ComponentLink1Description: https://datasheet.ciiva.com/5157/68000-274283-5157301.pdf?src-supplier=Mouser; ComponentLink2URL: https://datasheet.ciiva.com/46392/1914865-46392021.pdf?src-supplier=Element14; ComponentLink2Description: https://datasheet.ciiva.com/46392/1914865-46392021.pdf?src-supplier=Element14; ComponentLink3URL: https://datasheet.ciiva.com/10149/68000-10149754.pdf?src-supplier=Avnet; ComponentLink3Description: https://datasheet.ciiva.com/10149/68000-10149754.pdf?src-supplier=Avnet; Supplier Part Number 1: 609-3461-ND
L1 = 470nH ind: Manufacturer 1: KEMET; Manufacturer Part Number 1: MPX1D0520LR47; Supplier 1: Digi-Key; Stock 1: 890; Pricing 1: 1=1.72000, 10=1.59000, 25=1.45760, 50=1.24560, 100=1.11300, 250=0.95400, 500=0.90100, 1000=0.82150 (USD); RoHS: No; Supplier Part Number 1: 399-20628-1-ND
L2 L4 = BLM21PG300SN1D: Ferrite Beads Multi-Layer 30Ohm 100MHz 4A 14mOhm DCR 0805 T/R; Manufacturer 1: Murata; Material: Steel,Ferrite; Resistance: 15mR; Tolerance: 25%; Impedance: 30R; Number of Lines: 1; DC Resistance (DCR): 14mR; Max DC Current: 3A; Shielding: Unshielded; Supplier 1: Digi-Key; Manufacturer Part Number 1: BLM21PG300SN1D; Stock 1: 58891; Pricing 1: 1=0.11000, 10=0.09300, 25=0.07240, 50=0.06000, 100=0.05170, 250=0.04136, 500=0.03722, 1000=0.03102 (USD); RoHS: Yes; Case/Package: 0805; Number of Pins: 2; Core Material: Ferrite; Case Code (Metric): 2012; Case Code (Imperial): 0805; Min Operating Temperature: -55°C; Max Operating Temperature: 125°C; Packaging: Tape and Reel; Frequency: 100MHz; Package Quantity: 1; Max Current Rating: 4A; Current Rating: 4A; Termination: SMD/SMT; Test Frequency: 100MHz; DC Current: 3A; Military Standard: Not; Number of Circuits: 1; Length: 2mm; Height: 0.85mm; Width: 1.25mm; Depth: 1.25mm; Radiation Hardening: No; Lead Free: Lead Free; REACH SVHC: No SVHC; ComponentLink1URL: https://datasheet.ciiva.com/11795/0900766b80021a8e-11795584.pdf?src-supplier=RSComponents; ComponentLink1Description: https://datasheet.ciiva.com/11795/0900766b80021a8e-11795584.pdf?src-supplier=RSComponents; ComponentLink2URL: https://datasheet.ciiva.com/19460/1845339-19460237.pdf?src-supplier=Jameco; ComponentLink2Description: https://datasheet.ciiva.com/19460/1845339-19460237.pdf?src-supplier=Jameco; ComponentLink3URL: https://datasheet.ciiva.com/6212/l0110s0100blm21p-6212358.pdf?src-supplier=Digi-Key; ComponentLink3Description: https://datasheet.ciiva.com/6212/l0110s0100blm21p-6212358.pdf?src-supplier=Digi-Key; ComponentLink4URL: https://datasheet.ciiva.com/25903/l0110s0100blm21p-25903510.pdf?src-supplier=Avnet+Europe; ComponentLink4Description: https://datasheet.ciiva.com/25903/l0110s0100blm21p-25903510.pdf?src-supplier=Avnet+Europe; ComponentLink5URL: https://datasheet.ciiva.com/6212/l0110s0100blm21p-6212360.pdf?src-supplier=Digi-Key; ComponentLink5Description: https://datasheet.ciiva.com/6212/l0110s0100blm21p-6212360.pdf?src-supplier=Digi-Key; ComponentLink6URL: https://datasheet.ciiva.com/3081/l0110s0100blm21p-3081657.pdf?src-supplier=Avnet; ComponentLink6Description: https://datasheet.ciiva.com/3081/l0110s0100blm21p-3081657.pdf?src-supplier=Avnet; ComponentLink7URL: https://datasheet.ciiva.com/16199/l0110s0100blm21p-16199625.pdf?src-supplier=Future+Electronics; ComponentLink7Description: https://datasheet.ciiva.com/16199/l0110s0100blm21p-16199625.pdf?src-supplier=Future+Electronics; ComponentLink8URL: https://datasheet.ciiva.com/3081/l0110s0100blm21p-3081658.pdf?src-supplier=Avnet; ComponentLink8Description: https://datasheet.ciiva.com/3081/l0110s0100blm21p-3081658.pdf?src-supplier=Avnet; ComponentLink9URL: https://datasheet.ciiva.com/8021/1756152-8021599.pdf?src-supplier=Element14; ComponentLink9Description: https://datasheet.ciiva.com/8021/1756152-8021599.pdf?src-supplier=Element14; ComponentLink10URL: https://datasheet.ciiva.com/41449/001172365-da-01-en-drossel-0805-30r0-2-0x1-25mm-4000st-41449606.pdf?src-supplier=Conrad; ComponentLink10Description: https://datasheet.ciiva.com/41449/001172365-da-01-en-drossel-0805-30r0-2-0x1-25mm-4000st-41449606.pdf?src-supplier=Conrad; Supplier Part Number 1: 490-1052-1-ND
L3 = CDRH127/LDNP-4R6NC: FIXED IND 4.6UH 9.1A 13.8 MOHM; Manufacturer 1: Sumida; Core Material: Ferrite; DC Resistance (DCR): 13.8mR; Test Frequency: 100kHz; Tolerance: 30%; Shielding: Shielded; Supplier 1: Mouser; Manufacturer Part Number 1: CDRH127/LDNP-4R6NC; Stock 1: 232; Pricing 1: 1=1.52000, 10=1.14000, 100=1.08000, 500=0.87400, 1000=0.60800, 2500=0.57000 (USD); RoHS: Yes; Mount: Surface Mount; Case/Package: Nonstandard; Min Operating Temperature: -40°C; Max Operating Temperature: 100°C; Inductance: 4.6uH; Max DC Current: 9.1A; Termination: SMD/SMT; Package Quantity: 500; Current Rating: 9.1A; Packaging: Tape and Reel; Length: 0.472inch; Height: 8mm; Height - Seated (Max): 0.315inch; Depth: 12.3mm; Width: 0.472inch; Radiation Hardening: No; Lead Free: Lead Free; ComponentLink1URL: https://media.digikey.com/pdf/Data%20Sheets/Sumida%20PDFs/CDRH127LDNP.pdf?src-supplier=Digi-Key; ComponentLink1Description: https://media.digikey.com/pdf/Data%20Sheets/Sumida%20PDFs/CDRH127LDNP.pdf?src-supplier=Digi-Key; ComponentLink2URL: http://www.mouser.com/ds/2/390/CDRH127LD-523497.pdf?src-supplier=Mouser; ComponentLink2Description: http://www.mouser.com/ds/2/390/CDRH127LD-523497.pdf?src-supplier=Mouser; ComponentLink3URL: http://www.sumida.com/products/pdf/CDRH127,127LD.pdf?src-supplier=Avnet; ComponentLink3Description: http://www.sumida.com/products/pdf/CDRH127,127LD.pdf?src-supplier=Avnet; Supplier Part Number 1: 851-CDRH127LDNP4R6NC
LED1-LED3 = SMLLX1206ICTR: LED RED CLEAR 1206 SMD; Manufacturer 1: Lumex; Lens Color: Colorless,Clear; Forward Voltage: 2V; Luminous Intensity: 6mcd; Test Current: 20mA; Lens Style: Flat,Clear,Rectangular,Diffused,Colorless; Dominant Wavelength: 635nm; Viewing Angle: 160°; Number of LEDs: 1; Power Rating: 65mW; Current Rating: 25mA; Lens Size: 1.5mm; Approvals: UL,CSA; Supplier 1: Newark; Manufacturer Part Number 1: SMLLX1206ICTR; Stock 1: 0; RoHS: Yes; Mount: Surface Mount; Case/Package: 1206; Number of Pins: 2; Color: Red; Case Code (Metric): 3216; Case Code (Imperial): 1206; Min Operating Temperature: -25°C; Max Operating Temperature: 85°C; Packaging: Tape and Reel; Package Quantity: 3000; Forward Current: 20mA; Wavelength: 635nm; Illumination Color: Red; Lens Transparency: Clear; Voltage Rating (DC): 2V; Voltage Rating: 2V; Length: 3.2mm; Height: 1.1mm; Width: 1.6mm; Lead Free: Lead Free; REACH SVHC: No SVHC; ComponentLink1URL: https://datasheet.ciiva.com/16199/sml-lx1206ic-tr-16199616.pdf?src-supplier=Future+Electronics; ComponentLink1Description: https://datasheet.ciiva.com/16199/sml-lx1206ic-tr-16199616.pdf?src-supplier=Future+Electronics; ComponentLink2URL: https://datasheet.ciiva.com/12400/sml-lx1206ic-tr-112319-12400827.pdf?src-supplier=Mouser; ComponentLink2Description: https://datasheet.ciiva.com/12400/sml-lx1206ic-tr-112319-12400827.pdf?src-supplier=Mouser; ComponentLink3URL: https://datasheet.ciiva.com/8072/195796-8072871.pdf?src-supplier=Element14; ComponentLink3Description: https://datasheet.ciiva.com/8072/195796-8072871.pdf?src-supplier=Element14; ComponentLink4URL: https://datasheet.ciiva.com/8073/195796-8073097.pdf?src-supplier=Element14; ComponentLink4Description: https://datasheet.ciiva.com/8073/195796-8073097.pdf?src-supplier=Element14; ComponentLink5URL: https://datasheet.ciiva.com/15967/sml-lx1206ic-tr-15967210.pdf?src-supplier=Onlinecomponents.com; ComponentLink5Description: https://datasheet.ciiva.com/15967/sml-lx1206ic-tr-15967210.pdf?src-supplier=Onlinecomponents.com; ComponentLink6URL: https://datasheet.ciiva.com/30187/sml-lx1206ic-tr-30187578.pdf?src-supplier=Onlinecomponents.com; ComponentLink6Description: https://datasheet.ciiva.com/30187/sml-lx1206ic-tr-30187578.pdf?src-supplier=Onlinecomponents.com; ComponentLink7URL: https://datasheet.ciiva.com/2110/sml-lx1206ic-tr-2110300.pdf?src-supplier=Digi-Key; ComponentLink7Description: https://datasheet.ciiva.com/2110/sml-lx1206ic-tr-2110300.pdf?src-supplier=Digi-Key; ComponentLink8URL: https://datasheet.ciiva.com/2110/sml-lx1206ic-tr-2110301.pdf?src-supplier=Digi-Key; ComponentLink8Description: https://datasheet.ciiva.com/2110/sml-lx1206ic-tr-2110301.pdf?src-supplier=Digi-Key; ComponentLink9URL: https://datasheet.ciiva.com/2110/sml-lx1206ic-tr-2110302.pdf?src-supplier=Digi-Key; ComponentLink9Description: https://datasheet.ciiva.com/2110/sml-lx1206ic-tr-2110302.pdf?src-supplier=Digi-Key; Supplier Part Number 1: 80K7325
LED4 = LNJ311G83RA: Led Green SMD; Manufacturer 1: Panasonic SSG; Lens Style: Diffused; Forward Voltage: 2.03V; Wavelength: 575nm; Luminous Intensity: 12mcd; Test Current: 10mA; Supplier 1: Digi-Key; Manufacturer Part Number 1: LNJ311G83RA; Stock 1: 2890; Pricing 1: 1=0.56000, 10=0.40000, 100=0.26130, 500=0.18780, 1000=0.14697 (USD); RoHS: Yes; Mount: Surface Mount; Case/Package: 1206; Case Code (Metric): 3216; Case Code (Imperial): 1206; Color: Green; Packaging: Tape and Reel; Package Quantity: 3000; Length: 3.2mm; Height: 1.1mm; Width: 1.6mm; Lead Free: Lead Free; ComponentLink1URL: https://datasheet.ciiva.com/2122/lnj311g83ra-2122816.pdf?src-supplier=Digi-Key; ComponentLink1Description: https://datasheet.ciiva.com/2122/lnj311g83ra-2122816.pdf?src-supplier=Digi-Key; ComponentLink2URL: https://datasheet.ciiva.com/2122/lnj311g83ra-2122817.pdf?src-supplier=Digi-Key; ComponentLink2Description: https://datasheet.ciiva.com/2122/lnj311g83ra-2122817.pdf?src-supplier=Digi-Key; ComponentLink3URL: https://datasheet.ciiva.com/2122/lnj311g83ra-2122818.pdf?src-supplier=Digi-Key; ComponentLink3Description: https://datasheet.ciiva.com/2122/lnj311g83ra-2122818.pdf?src-supplier=Digi-Key; Supplier Part Number 1: P11537CT-ND
PB1 = FSMRA4JH04: TE CONNECTIVITY - FSMRA4JH04 - SWITCH, TACT, SPST; Mechanical Life: 100000Cycles; Illumination Type: Illuminated; Contact Current Rating: 50mA; Voltage Rating: 24V; Operating Force: 1.6N; Actuator Length: 5.74mm; Supplier 1: Mouser; Manufacturer 1: TE Connectivity; Manufacturer Part Number 1: FSMRA4JH04; Stock 1: 20272; Pricing 1: 1=0.25000, 10=0.25000, 25=0.23300, 100=0.22000, 250=0.20700, 500=0.19000 (USD); RoHS: Yes; Mount: Through Hole,PCB; Contact Material: Copper Alloy; Min Operating Temperature: -35°C; Max Operating Temperature: 85°C; Throw Configuration: SPST; Termination: Solder; Voltage Rating (DC): 24V; Current Rating: 50mA; Package Quantity: 1000; Packaging: Bulk; Length: 7.11mm; Width: 7.01mm; REACH SVHC: Unknown; ComponentLink1URL: https://datasheet.ciiva.com/5809/606398-5809313.pdf?src-supplier=Farnell; ComponentLink1Description: https://datasheet.ciiva.com/5809/606398-5809313.pdf?src-supplier=Farnell; ComponentLink2URL: https://datasheet.ciiva.com/7635/606398-7635446.pdf?src-supplier=Element14; ComponentLink2Description: https://datasheet.ciiva.com/7635/606398-7635446.pdf?src-supplier=Element14; Supplier Part Number 1: 506-FSMRA4JH04
Q1-Q3 Q6 = ECH8310-TL-H: Trans MOSFET P-CH 30V 9A 8-Pin ECH T/R; Manufacturer 1: ON Semiconductor; Input Capacitance: 1.4nF; Max Power Dissipation: 1.5W; Rds On Max: 17mR; Rise Time: 45ns; Turn-Off Delay Time: 134ns; Turn-On Delay Time: 10ns; Fall Time: 87ns; Element Configuration: Single; Gate to Source Voltage (Vgs): 20V; Supplier 1: Digi-Key; Manufacturer Part Number 1: ECH8310-TL-H; Stock 1: 2258; Pricing 1: 1=0.68000, 10=0.59400, 25=0.55800, 100=0.40500, 500=0.33840, 1000=0.28800 (USD); RoHS: Yes; Number of Pins: 8; Min Operating Temperature: -55°C; Max Operating Temperature: 150°C; Package Quantity: 3000; Packaging: Tape and Reel; Drain to Source Voltage (Vdss): 30V; Continuous Drain Current (ID): 9A; Drain to Source Resistance: 17mR; Length: 2.9mm; Height: 0.9mm; Width: 2.3mm; Radiation Hardening: No; Lead Free: Lead Free; Halogen Free: Halogen Free; ComponentLink1URL: https://datasheet.ciiva.com/13052/ech8310-d-72318-13052832.pdf?src-supplier=Mouser; ComponentLink1Description: https://datasheet.ciiva.com/13052/ech8310-d-72318-13052832.pdf?src-supplier=Mouser; ComponentLink2URL: https://datasheet.ciiva.com/30479/0900766b8127c97b-30479731.pdf?src-supplier=RSComponents; ComponentLink2Description: https://datasheet.ciiva.com/30479/0900766b8127c97b-30479731.pdf?src-supplier=RSComponents; ComponentLink3URL: https://datasheet.ciiva.com/6371/ech8310-d-6371820.pdf?src-supplier=Digi-Key; ComponentLink3Description: https://datasheet.ciiva.com/6371/ech8310-d-6371820.pdf?src-supplier=Digi-Key; ComponentLink4URL: https://datasheet.ciiva.com/11164/ech8310-d-11164927.pdf?src-supplier=Avnet; ComponentLink4Description: https://datasheet.ciiva.com/11164/ech8310-d-11164927.pdf?src-supplier=Avnet; Supplier Part Number 1: ECH8310-TL-HOSCT-ND
Q4 Q5 = NTTFS4H05NTAG: Single N−Channel Power MOSFET 25V, 94A, 3.3mΩ; Manufacturer 1: ON Semiconductor; Rds On Max: 3.3mR; Input Capacitance: 1.205nF; Max Power Dissipation: 2.66W; Supplier 1: Mouser; Manufacturer Part Number 1: NTTFS4H05NTAG; Stock 1: 792; Pricing 1: 1=1.39000, 10=1.18000, 100=0.89600, 250=0.87000, 500=0.75200, 1000=0.62000 (USD); RoHS: Yes; Mount: Surface Mount; Number of Pins: 8; Package Quantity: 1500; Packaging: Tape and Reel; Drain to Source Voltage (Vdss): 25V; Continuous Drain Current (ID): 94A; Lead Free: Lead Free; ComponentLink1URL: http://www.mouser.com/ds/2/308/NTTFS4H05N-D-463776.pdf?src-supplier=Mouser; ComponentLink1Description: http://www.mouser.com/ds/2/308/NTTFS4H05N-D-463776.pdf?src-supplier=Mouser; ComponentLink2URL: http://www.onsemi.com/pub/Collateral/NTTFS4H05N-D.PDF?src-supplier=Digi-Key; ComponentLink2Description: http://www.onsemi.com/pub/Collateral/NTTFS4H05N-D.PDF?src-supplier=Digi-Key; ComponentLink3URL: http://www.onsemi.com/pub/Collateral/NTTFS4H05N-D.PDF?src-supplier=Avnet; ComponentLink3Description: http://www.onsemi.com/pub/Collateral/NTTFS4H05N-D.PDF?src-supplier=Avnet; Supplier Part Number 1: 863-NTTFS4H05NTAG
R1 R6 R30 R34 = RC0805FR-07100KL: RES SMD 100K OHM 1% 1/8W 0805; Manufacturer 1: Yageo; Resistance: 100kR; Temperature Coefficient: 100ppm/°C; Power Rating: 125mW; Voltage Rating (DC): 150V; Supplier 1: Digi-Key; Manufacturer Part Number 1: RC0805FR-07100KL; Stock 1: 7970099; Pricing 1: 1=0.10000, 10=0.04000, 100=0.01610, 1000=0.00723, 2500=0.00628 (USD); RoHS: Yes; Case/Package: 0805; Number of Pins: 2; Case Code (Metric): 2012; Case Code (Imperial): 0805; Min Operating Temperature: -55°C; Max Operating Temperature: 155°C; Composition: Thick Film; Tolerance: 1%; Packaging: Tape and Reel; Voltage Rating: 150V; Package Quantity: 1; Number of Terminations: 2; Termination: SMD/SMT; Military Standard: Not; Max Power Dissipation: 125mW; Features: Moisture Resistant; Length: 2mm; Height: 0.024inch; Width: 0.049inch; Depth: 1.25mm; Lead Pitch: 0.4mm; REACH SVHC: Unknown; Lead Free: Lead Free; ComponentLink1URL: https://datasheet.ciiva.com/11808/0900766b8106beab-11808858.pdf?src-supplier=RSComponents; ComponentLink1Description: https://datasheet.ciiva.com/11808/0900766b8106beab-11808858.pdf?src-supplier=RSComponents; ComponentLink2URL: https://datasheet.ciiva.com/2457/pyu-r-int-thick-7-2457017.pdf?src-supplier=Digi-Key; ComponentLink2Description: https://datasheet.ciiva.com/2457/pyu-r-int-thick-7-2457017.pdf?src-supplier=Digi-Key; ComponentLink3URL: https://datasheet.ciiva.com/12667/rc0805-12667001.pdf?src-supplier=Mouser; ComponentLink3Description: https://datasheet.ciiva.com/12667/rc0805-12667001.pdf?src-supplier=Mouser; ComponentLink4URL: https://datasheet.ciiva.com/2457/pyu-r-int-thick-7-2457018.pdf?src-supplier=Digi-Key; ComponentLink4Description: https://datasheet.ciiva.com/2457/pyu-r-int-thick-7-2457018.pdf?src-supplier=Digi-Key; ComponentLink5URL: https://datasheet.ciiva.com/16747/rc0805-16747226.pdf?src-supplier=Future+Electronics; ComponentLink5Description: https://datasheet.ciiva.com/16747/rc0805-16747226.pdf?src-supplier=Future+Electronics; ComponentLink6URL: https://datasheet.ciiva.com/2457/pyu-r-int-thick-7-2457019.pdf?src-supplier=Digi-Key; ComponentLink6Description: https://datasheet.ciiva.com/2457/pyu-r-int-thick-7-2457019.pdf?src-supplier=Digi-Key; ComponentLink7URL: https://datasheet.ciiva.com/7660/38627-7660796.pdf?src-supplier=Element14; ComponentLink7Description: https://datasheet.ciiva.com/7660/38627-7660796.pdf?src-supplier=Element14; ComponentLink8URL: https://datasheet.ciiva.com/7941/1697719-7941676.pdf?src-supplier=Element14; ComponentLink8Description: https://datasheet.ciiva.com/7941/1697719-7941676.pdf?src-supplier=Element14; ComponentLink9URL: https://datasheet.ciiva.com/7941/1686128-7941677.pdf?src-supplier=Element14; ComponentLink9Description: https://datasheet.ciiva.com/7941/1686128-7941677.pdf?src-supplier=Element14; ComponentLink10URL: https://datasheet.ciiva.com/7941/1697719-7941678.pdf?src-supplier=Element14; ComponentLink10Description: https://datasheet.ciiva.com/7941/1697719-7941678.pdf?src-supplier=Element14; ComponentLink11URL: https://datasheet.ciiva.com/22747/444164-22747534.pdf?src-supplier=Element14; ComponentLink11Description: https://datasheet.ciiva.com/22747/444164-22747534.pdf?src-supplier=Element14; Supplier Part Number 1: 311-100KCRCT-ND
R2-R5 = RC0805JR-07330RL: YAGEO   RC0805JR-07330RL   THICK FILM RESISTOR, 330 OHM, 125mW, 5%, FULL REEL; Resistance: 330R; Voltage Rating: 150V; Temperature Coefficient: 100ppm/°C; Supplier 1: Digi-Key; Manufacturer 1: Yageo; Manufacturer Part Number 1: RC0805JR-07330RL; Stock 1: 1367649; Pricing 1: 1=0.10000, 10=0.03300, 100=0.01350, 1000=0.00607, 2500=0.00527 (USD); RoHS: Yes; Case/Package: 0805; Contact Plating: Tin,Matte,Lead; Case Code (Imperial): 0805; Case Code (Metric): 2012; Min Operating Temperature: -55°C; Max Operating Temperature: 155°C; Package Quantity: 5000; Tolerance: 5%; Power Rating: 125mW; Packaging: Tape and Reel; Termination: SMD/SMT; Composition: Thick Film; Military Standard: Not; Length: 2mm; Height: 0.5mm; Width: 1.25mm; Depth: 1.25mm; Radiation Hardening: No; Lead Free: Lead Free; REACH SVHC: No SVHC; ComponentLink1URL: https://datasheet.ciiva.com/17008/rc0805-17008395.pdf?src-supplier=Future+Electronics; ComponentLink1Description: https://datasheet.ciiva.com/17008/rc0805-17008395.pdf?src-supplier=Future+Electronics; ComponentLink2URL: https://datasheet.ciiva.com/46395/444164-46395119.pdf?src-supplier=Element14; ComponentLink2Description: https://datasheet.ciiva.com/46395/444164-46395119.pdf?src-supplier=Element14; ComponentLink3URL: https://datasheet.ciiva.com/7941/442941-7941941.pdf?src-supplier=Element14; ComponentLink3Description: https://datasheet.ciiva.com/7941/442941-7941941.pdf?src-supplier=Element14; ComponentLink4URL: https://datasheet.ciiva.com/7941/442941-7941942.pdf?src-supplier=Element14; ComponentLink4Description: https://datasheet.ciiva.com/7941/442941-7941942.pdf?src-supplier=Element14; ComponentLink5URL: https://datasheet.ciiva.com/12555/rc0805-257173-12555078.pdf?src-supplier=Mouser; ComponentLink5Description: https://datasheet.ciiva.com/12555/rc0805-257173-12555078.pdf?src-supplier=Mouser; Supplier Part Number 1: 311-330ARCT-ND